# Altium schematic sheet 7_DDR3L.SchDoc: DDR3L Configuration
size Legal; Date: 12/28/2025; Author: Praveen Perera; DrawnBy: Praveen Perera; Engineer: Praveen Perera; Revision: 0; SheetNumber: 7; SheetTotal: 9
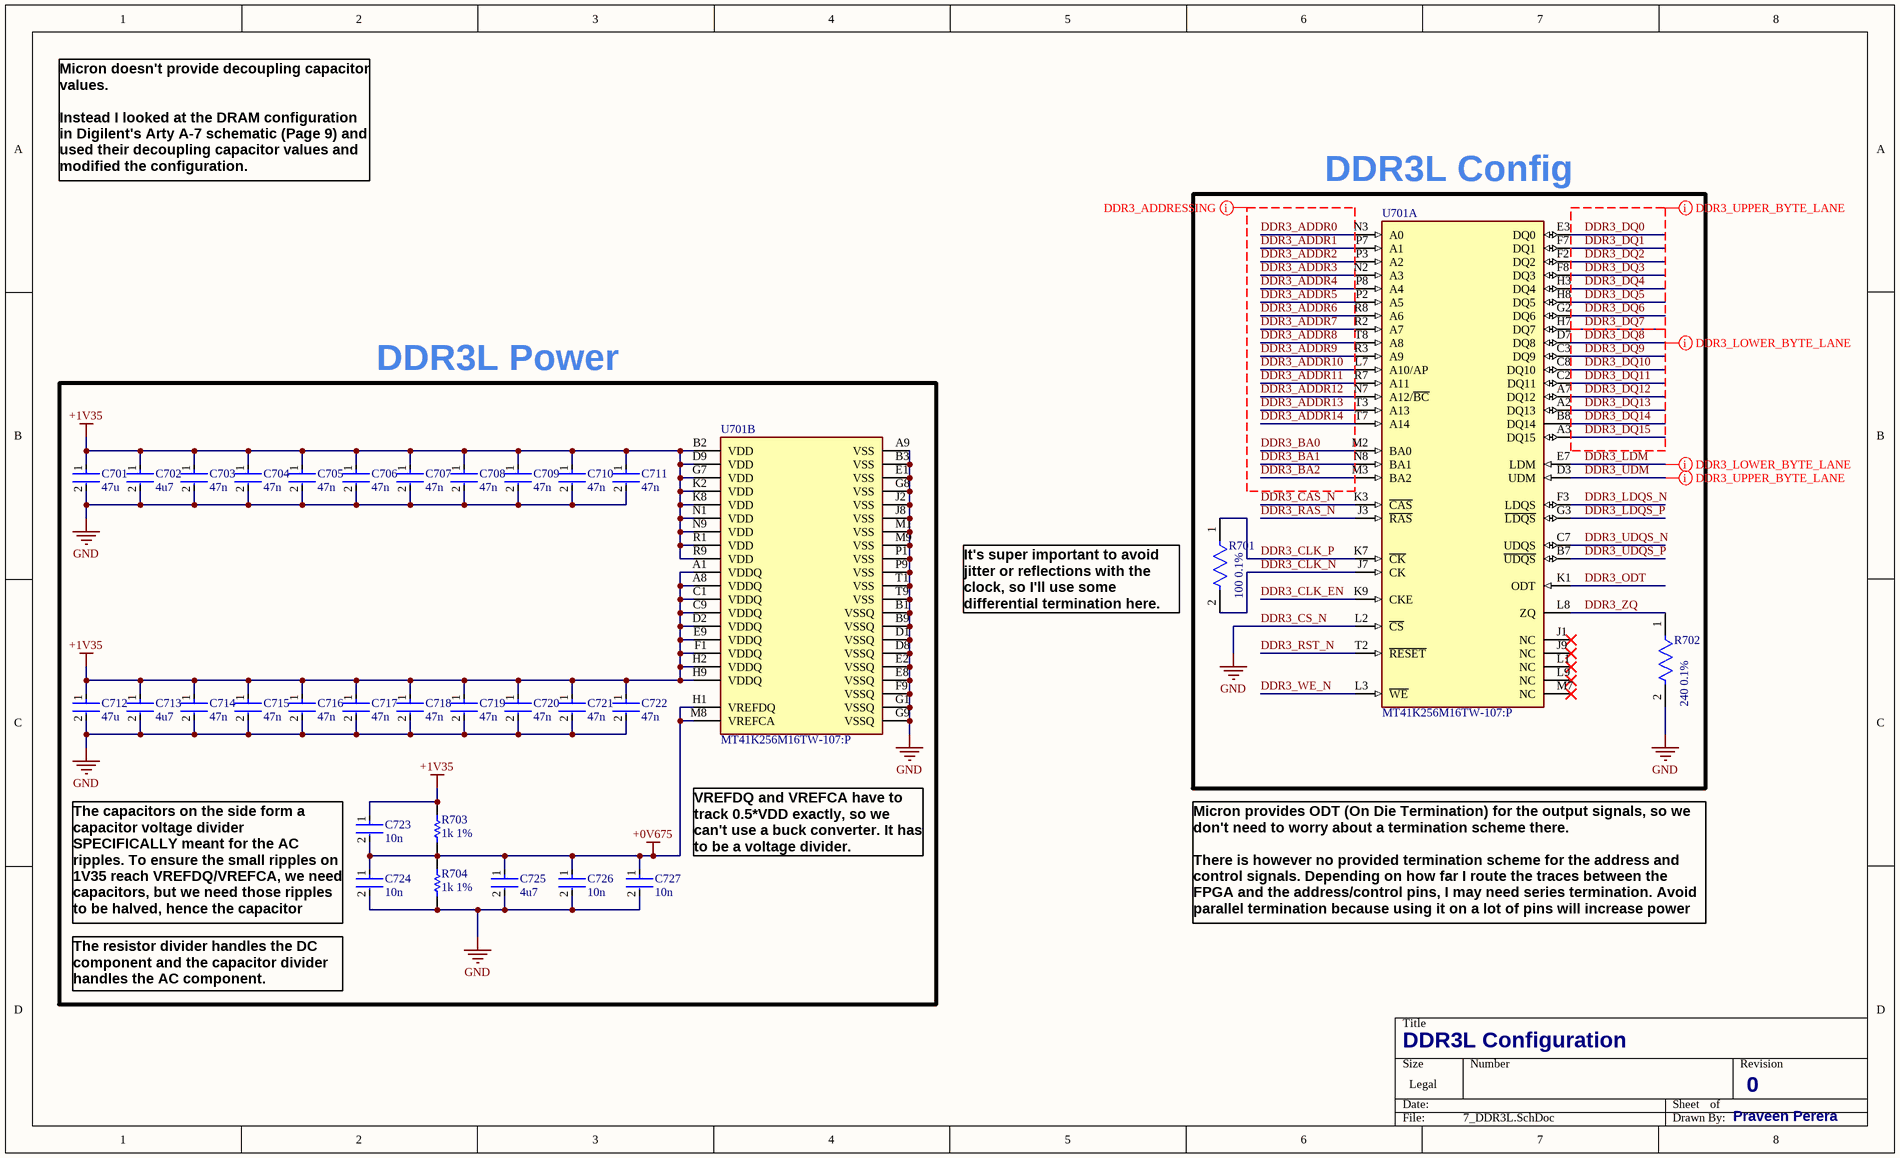
[diagram p0: 7_DDR3L.SchDoc]

## Parts
C701  47u  [FP-GRM188-0_2-IPC_B]
C702  4u7  [FP-CL829-IPC_C]
C703  47n  [FP-C0603-030-0_03-IPC_A]
C704  47n  [FP-C0603-030-0_03-IPC_A]
C705  47n  [FP-C0603-030-0_03-IPC_A]
C706  47n  [FP-C0603-030-0_03-IPC_A]
C707  47n  [FP-C0603-030-0_03-IPC_A]
C708  47n  [FP-C0603-030-0_03-IPC_A]
C709  47n  [FP-C0603-030-0_03-IPC_A]
C710  47n  [FP-C0603-030-0_03-IPC_A]
C711  47n  [FP-C0603-030-0_03-IPC_A]
C712  47u  [FP-GRM188-0_2-IPC_B]
C713  4u7  [FP-CL829-IPC_C]
C714  47n  [FP-C0603-030-0_03-IPC_A]
C715  47n  [FP-C0603-030-0_03-IPC_A]
C716  47n  [FP-C0603-030-0_03-IPC_A]
C717  47n  [FP-C0603-030-0_03-IPC_A]
C718  47n  [FP-C0603-030-0_03-IPC_A]
C719  47n  [FP-C0603-030-0_03-IPC_A]
C720  47n  [FP-C0603-030-0_03-IPC_A]
C721  47n  [FP-C0603-030-0_03-IPC_A]
C722  47n  [FP-C0603-030-0_03-IPC_A]
C723  10n  [FP-GCM155-0_05-IPC_C]
C724  10n  [FP-GCM155-0_05-IPC_C]
C725  4u7  [FP-CL829-IPC_C]
C726  10n  [FP-GCM155-0_05-IPC_C]
C727  10n  [FP-GCM155-0_05-IPC_C]
R701  100 0.1%  [FP-ERA1A-IPC_B]
R702  240 0.1%  [FP-RT0201-MFG]
R703  1k 1%  [RESC0603X28X15NL05T05]
R704  1k 1%  [RESC0603X28X15NL05T05]
U701  MT41K256M16TW-107:P  [FP-TW-IPC_C]  (parts A,B of 2)

## Nets
+0V675: C723.2 C724.1 C725.1 C726.1 C727.1 R703.1 R704.2 U701.H1(VREFDQ) U701.M8(VREFCA)
+1V35: C701.1 C702.1 C703.1 C704.1 C705.1 C706.1 C707.1 C708.1 C709.1 C710.1 C711.1 C712.1 C713.1 C714.1 C715.1 C716.1 C717.1 C718.1 C719.1 C720.1 C721.1 C722.1 C723.1 R703.2 U701.A1(VDDQ) U701.A8(VDDQ) U701.B2(VDD) U701.C1(VDDQ) U701.C9(VDDQ) U701.D2(VDDQ) U701.D9(VDD) U701.E9(VDDQ) U701.F1(VDDQ) U701.G7(VDD) U701.H2(VDDQ) U701.H9(VDDQ) U701.K2(VDD) U701.K8(VDD) U701.N1(VDD) U701.N9(VDD) U701.R1(VDD) U701.R9(VDD)
DDR3_CS_N: C701.2 C702.2 C703.2 C704.2 C705.2 C706.2 C707.2 C708.2 C709.2 C710.2 C711.2 C712.2 C713.2 C714.2 C715.2 C716.2 C717.2 C718.2 C719.2 C720.2 C721.2 C722.2 C724.2 C725.2 C726.2 C727.2 R702.2 R704.1 U701.A9(VSS) U701.B1(VSSQ) U701.B3(VSS) U701.B9(VSSQ) U701.D1(VSSQ) U701.D8(VSSQ) U701.E1(VSS) U701.E2(VSSQ) U701.E8(VSSQ) U701.F9(VSSQ) U701.G1(VSSQ) U701.G8(VSS) U701.G9(VSSQ) U701.J2(VSS) U701.J8(VSS) U701.L2(~{CS}) U701.M1(VSS) U701.M9(VSS) U701.P1(VSS) U701.P9(VSS) U701.T1(VSS) U701.T9(VSS)  [also labelled GND]
DDR3_ADDR0: U701.N3(A0)
DDR3_ADDR1: U701.P7(A1)
DDR3_ADDR2: U701.P3(A2)
DDR3_ADDR3: U701.N2(A3)
DDR3_ADDR4: U701.P8(A4)
DDR3_ADDR5: U701.P2(A5)
DDR3_ADDR6: U701.R8(A6)
DDR3_ADDR7: U701.R2(A7)
DDR3_ADDR8: U701.T8(A8)
DDR3_ADDR9: U701.R3(A9)
DDR3_ADDR10: U701.L7(A10/AP)
DDR3_ADDR11: U701.R7(A11)
DDR3_ADDR12: U701.N7(A12/~{BC})
DDR3_ADDR13: U701.T3(A13)
DDR3_ADDR14: U701.T7(A14)
DDR3_BA0: U701.M2(BA0)
DDR3_BA1: U701.N8(BA1)
DDR3_BA2: U701.M3(BA2)
DDR3_CAS_N: U701.K3(~{CAS})
DDR3_CLK_EN: U701.K9(CKE)
DDR3_CLK_N: R701.2 U701.J7(CK)
DDR3_CLK_P: R701.1 U701.K7(~{CK})
DDR3_DQ0: U701.E3(DQ0)
DDR3_DQ1: U701.F7(DQ1)
DDR3_DQ2: U701.F2(DQ2)
DDR3_DQ3: U701.F8(DQ3)
DDR3_DQ4: U701.H3(DQ4)
DDR3_DQ5: U701.H8(DQ5)
DDR3_DQ6: U701.G2(DQ6)
DDR3_DQ7: U701.H7(DQ7)
DDR3_DQ8: U701.D7(DQ8)
DDR3_DQ9: U701.C3(DQ9)
DDR3_DQ10: U701.C8(DQ10)
DDR3_DQ11: U701.C2(DQ11)
DDR3_DQ12: U701.A7(DQ12)
DDR3_DQ13: U701.A2(DQ13)
DDR3_DQ14: U701.B8(DQ14)
DDR3_DQ15: U701.A3(DQ15)
DDR3_LDM: U701.E7(LDM)
DDR3_LDQS_N: U701.F3(LDQS)
DDR3_LDQS_P: U701.G3(~{LDQS})
DDR3_ODT: U701.K1(ODT)
DDR3_RAS_N: U701.J3(~{RAS})
DDR3_RST_N: U701.T2(~{RESET})
DDR3_UDM: U701.D3(UDM)
DDR3_UDQS_N: U701.C7(UDQS)
DDR3_UDQS_P: U701.B7(~{UDQS})
DDR3_WE_N: U701.L3(~{WE})
DDR3_ZQ: R702.1 U701.L8(ZQ)

Not connected (* = marked no-connect by the designer): U701 J1(NC)* J9(NC)* L1(NC)* L9(NC)* M7(NC)*

## Layout directives
mark named DDR3_ADDRESSING: DDR3_ADDR0, DDR3_ADDR1, DDR3_ADDR2, DDR3_ADDR3, DDR3_ADDR4, DDR3_ADDR5, DDR3_ADDR6, DDR3_ADDR7, DDR3_ADDR8, DDR3_ADDR9, DDR3_ADDR10, DDR3_ADDR11, DDR3_ADDR12, DDR3_ADDR13, DDR3_ADDR14, DDR3_BA0, DDR3_BA1, DDR3_BA2
mark named DDR3_UPPER_BYTE_LANE: DDR3_DQ0, DDR3_DQ1, DDR3_DQ2, DDR3_DQ3, DDR3_DQ4, DDR3_DQ5, DDR3_DQ6, DDR3_DQ7, DDR3_UDM
mark named DDR3_LOWER_BYTE_LANE: DDR3_DQ8, DDR3_LDM

## Notes on the sheet
- Micron doesn't provide decoupling capacitor values.
  Instead I looked at the DRAM configuration in Digilent's Arty A-7 schematic (Page 9) and used their decoupling capacitor values and modified the configuration.
- (near U701) DDR3L Config
- DDR3L Power
- (near R701) It's super important to avoid jitter or reflections with the clock, so I'll use some differential termination here.
- VREFDQ and VREFCA have to track 0.5*VDD exactly, so we can't use a buck converter. It has to be a voltage divider.
- The capacitors on the side form a capacitor voltage divider SPECIFICALLY meant for the AC ripples. To ensure the small ripples on 1V35 reach VREFDQ/VREFCA, we need capacitors, but we need those ripples to be halved, hence the capacitor divider.
- Micron provides ODT (On Die Termination) for the output signals, so we don't need to worry about a termination scheme there.
  There is however no provided termination scheme for the address and control signals. Depending on how far I route the traces between the FPGA and the address/control pins, I may need series termination. Avoid parallel termination because using it on a lot of pins will increase power draw.
- The resistor divider handles the DC component and the capacitor divider handles the AC component.

## Library data of the parts
C701 C712 = CMP-2000-05444-2: GRM188R60J476ME15D / Chip Multilayer Ceramic Capacitors for General Purpose, 0603, 47uF, X5R, 15%, 20%, 6.3V; Voltage Rating (DC): 6.3V; Thickness: 0.039inch; Case Code (Imperial): 0603; Packaging: Tape and Reel; Capacitance: 47uF; Width: 0.031inch; Dielectric: X5R; Max Operating Temperature: 85°C; Mount: Surface Mount; Case Code (Metric): 1608; Length: 0.063inch; Voltage Rating: 6.3V; Tolerance: 20%; Case/Package: 0603; Min Operating Temperature: -55°C
C702 C713 C725 = CMP-13271-001468-1: CL05A475MO5NUNC / Cap Ceramic 4.7uF 16V X5R ±20% SMD 0402 +85°C Paper T/R; Mount: Surface Mount; Case Code (Metric): 1005; Case/Package: 0402; Length: 0.039inch; Capacitance: 4.7uF; Voltage Rating: 16V; Max Operating Temperature: 85°C; Tolerance: 20%; Thickness: 0.022inch; Min Operating Temperature: -55°C; Case Code (Imperial): 0402; Packaging: Tape and Reel; Width: 0.02inch
C703-C711 C714-C722 = CMP-08246-004548-1: C0603X5R1E473K030BB / Multilayer Ceramic Capacitors 47nF ±10% 25V X5R SMD 0201; Min Operating Temperature: -55°C; Case Code (Imperial): 0201; Termination: SMD/SMT; Voltage Rating (DC): 25V; Max Operating Temperature: 85°C; Case Code (Metric): 0603; Dielectric: X5R; Voltage Rating: 25V; RoHS Compliant: Yes; Thickness: 0.013inch; Length: 0.024inch; Dielectric Material: Ceramic; Width: 0.3mm; Capacitance: 47nF; Case/Package: 0201; Series: C; Tolerance: 10%; Packaging: Tape and Reel; Weight: 6E-06oz; Height: 0.3mm; Package Quantity: 15000; Mount: Surface Mount; Lead Free: Lead Free
C723 C724 C726 C727 = CMP-2008-03715-2: GCM155R71E103KA37D / Ceramic Capacitor for Automotive 10nF ±10% 25VDC X7R 0402 Paper T/R; Voltage Rating (DC): 25V; Packaging: Tape and Reel; Case/Package: 0402; Max Operating Temperature: 125°C; Radiation Hardening: No; Case Code (Metric): 1005; Termination: SMD/SMT; Mount: Surface Mount; Voltage: 25V; Width: 0.02inch; Dielectric: X7R; Height: 0.5mm; Depth: 0.5mm; Length: 1mm; Package Quantity: 1; Thickness: 0.022inch; Voltage Rating: 25V; Case Code (Imperial): 0402; Ratings: AEC-Q200; Capacitance: 10nF; REACH SVHC: No SVHC; Lead Free: Lead Free; Min Operating Temperature: -55°C; Tolerance: 10%
R701 = CMP-05422-000095-1: ERA-1AEB101C / RES SMD 100 OHM 0.1% 1/20W 0201; Max Power Dissipation: 50mW; Resistance: 100R; Temperature Coefficient: 25ppm/°C; Lead Free: Lead Free; Width: 0.012inch; Max Operating Temperature: 155°C; Features: Automotive AEC-Q200; Packaging: Tape and Reel; Length: 0.024inch; Number of Terminations: 2; Case Code (Imperial): 0201; Case/Package: 0201; Case Code (Metric): 0603; Tolerance: 0.1%; Min Operating Temperature: -55°C; Height: 0.009inch; Resistor Type: Thin Film
R702 = CMP-03412-015201-1: RT0201BRD07240RL / RT0201 240Ω 0.05W 25 ppm/°C 0.10%; Manufacturer: Yageo; Tolerance: 0.001; Voltage Rating: 25V; Temperature Coefficient: 25 ppm/°C; RoHS: TRUE; Temperature Range High: +125°C; Footprint Url: http://www.yageo.com/exep/pages/download/literatures/PYu-R_Mount_10.pdf; Octopart: https://octopart.com/rt0201brd07240rl-yageo-87214234; Device Class L1: Passive Components; Manufacturer Part Number: RT0201BRD07240RL; Device Class L3: Chip SMD Resistors; Series: RT; Automotive: No; Ipc Land Pattern Name: RESC6030X23; Composition: Thin Film; Value: 240Ω; Power Rating: 0.05W; Temperature Range Low: -55°C; Category: Res; Lead Free: Yes; Resistance: 240Ω; Temperature: -55°C to +125°C; Device Class L2: Resistors; ComponentLink2URL: http://www.yageo.com/documents/recent/PYu-RT_1-to-0.01_RoHS_L_9.pdf; ComponentLink2Description: Datasheet; Package: RT0201; Height: 0.26mm
R703 R704 = CMP-2004-00208-1: CRCW02011K00FKED; Manufacturer: Vishay Dale; Part Number: CRCW02011K00FKED
U701 = CMP-2000-07475-2: IC DRAM 4G PARALLEL 96FBGA; Manufacturer: Micron; Access Time: 1.07ns; Nominal Supply Current: 12-156mA; Min Supply Voltage: 1.283V; Memory Type: SDRAM,DDR3; Standoff Height: 0.29mm; Max Supply Voltage: 1.45V; Memory Size: 4Gbits; Device Class L1: Integrated Circuits (ICs); Lead Free: Yes; ComponentLink2Description: Datasheet; Manufacturer Part Number: MT41K256M16TW-107:P; Category: IC; Digikey Description: IC DRAM 4G PARALLEL 96FBGA; Device Class L3: RAM; Interface: Parallel; RoHS: TRUE; Octopart: https://octopart.com/mt41k256m16tw-107%3Ap-micron-66533852; Temperature Range High: +85°C; ComponentLink2URL: https://www.micron.com/-/media/client/global/documents/products/data-sheet/dram/ddr3/4gb_ddr3l.pdf; Temperature: 0°C to +85°C; Package: TW; Device Class L2: Memory; Automotive: No; Height: 1.2mm; Temperature Range Low: 0°C